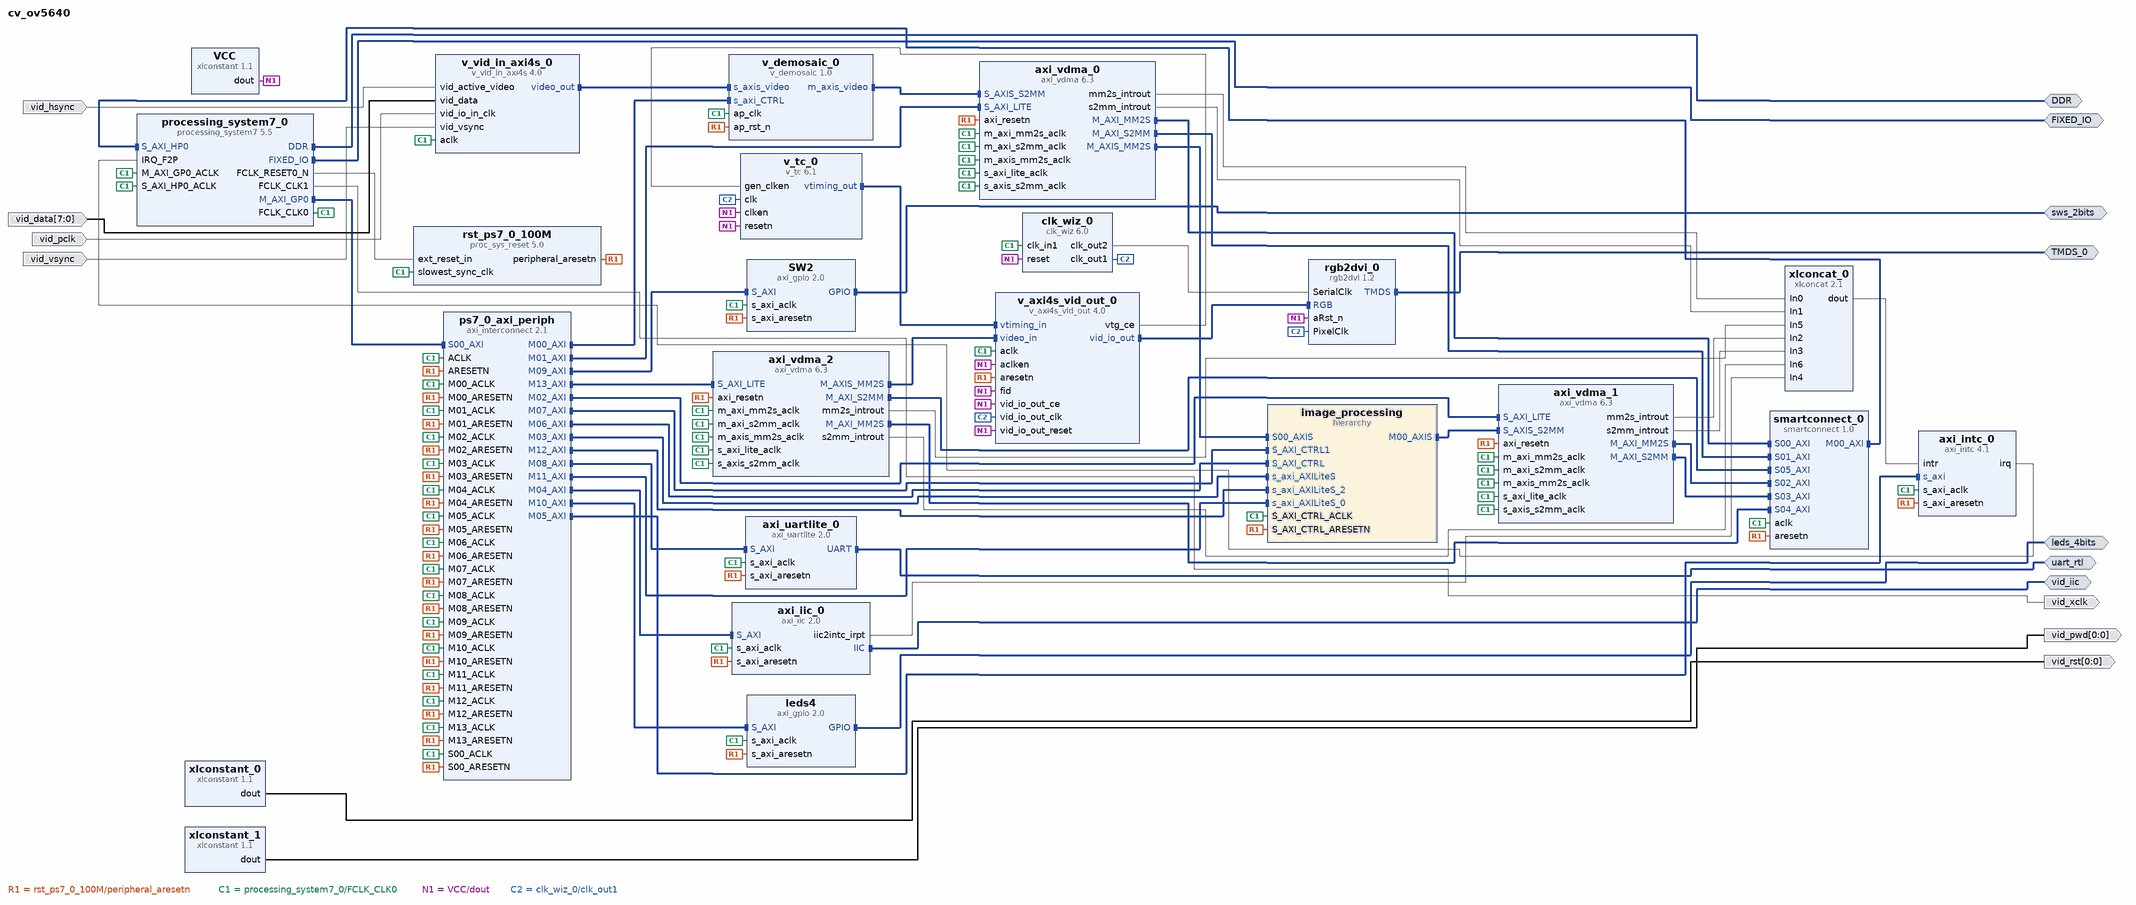
[diagram p0: block diagram of the top level]
# Vivado block design cv_ov5640, xc7z020clg400-1, Vivado 2018.3
create_bd_design cv_ov5640

create_bd_intf_port -mode Master -vlnv xilinx.com:interface:ddrx_rtl:1.0 DDR
create_bd_intf_port -mode Master -vlnv xilinx.com:display_processing_system7:fixedio_rtl:1.0 FIXED_IO
create_bd_intf_port -mode Master -vlnv digilentinc.com:interface:tmds_rtl:1.0 TMDS_0
create_bd_intf_port -mode Master -vlnv xilinx.com:interface:iic_rtl:1.0 vid_iic
create_bd_intf_port -mode Master -vlnv xilinx.com:interface:uart_rtl:1.0 uart_rtl
create_bd_intf_port -mode Master -vlnv xilinx.com:interface:gpio_rtl:1.0 sws_2bits
create_bd_intf_port -mode Master -vlnv xilinx.com:interface:gpio_rtl:1.0 leds_4bits
create_bd_port -dir I -from 7 -to 0 vid_data
create_bd_port -dir I vid_hsync
create_bd_port -dir I -type clk vid_pclk
set_property -dict {CONFIG.FREQ_HZ 74250000} [get_bd_ports vid_pclk]
create_bd_port -dir O -from 0 -to 0 vid_pwd
create_bd_port -dir O -from 0 -to 0 vid_rst
create_bd_port -dir I vid_vsync
create_bd_port -dir O -type clk vid_xclk
set_property -dict {CONFIG.FREQ_HZ 23809525} [get_bd_ports vid_xclk]

create_bd_cell -type ip -vlnv xilinx.com:ip:axi_iic:2.0 axi_iic_0
set_property -dict {CONFIG.IIC_FREQ_KHZ 100} [get_bd_cells axi_iic_0]
create_bd_cell -type ip -vlnv xilinx.com:ip:axi_intc:4.1 axi_intc_0
set_property -dict {CONFIG.C_IRQ_CONNECTION 1} [get_bd_cells axi_intc_0]
create_bd_cell -type ip -vlnv xilinx.com:ip:axi_vdma:6.3 axi_vdma_0
set_property -dict {CONFIG.c_m_axis_mm2s_tdata_width 24} [get_bd_cells axi_vdma_0]
create_bd_cell -type ip -vlnv xilinx.com:ip:axi_vdma:6.3 axi_vdma_1
set_property -dict {CONFIG.c_m_axis_mm2s_tdata_width 24 CONFIG.c_num_fstores 3} [get_bd_cells axi_vdma_1]
create_bd_cell -type ip -vlnv xilinx.com:ip:clk_wiz:6.0 clk_wiz_0
set_property -dict [list \
  CONFIG.CLKOUT1_JITTER 337.616 \
  CONFIG.CLKOUT1_PHASE_ERROR 322.999 \
  CONFIG.CLKOUT1_REQUESTED_OUT_FREQ 74.25 \
  CONFIG.CLKOUT2_JITTER 258.703 \
  CONFIG.CLKOUT2_PHASE_ERROR 322.999 \
  CONFIG.CLKOUT2_REQUESTED_OUT_FREQ 371.25 \
  CONFIG.CLKOUT2_USED true \
  CONFIG.MMCM_CLKFBOUT_MULT_F 37.125 \
  CONFIG.MMCM_CLKOUT0_DIVIDE_F 10.000 \
  CONFIG.MMCM_CLKOUT1_DIVIDE 2 \
  CONFIG.MMCM_DIVCLK_DIVIDE 5 \
  CONFIG.NUM_OUT_CLKS 2 \
  CONFIG.USE_LOCKED false \
  CONFIG.USE_RESET true \
] [get_bd_cells clk_wiz_0]
create_bd_cell -type hier image_processing
create_bd_cell -type ip -vlnv xilinx.com:ip:processing_system7:5.5 processing_system7_0
set_property -dict [list \
  CONFIG.PCW_APU_PERIPHERAL_FREQMHZ 650 \
  CONFIG.PCW_CRYSTAL_PERIPHERAL_FREQMHZ 50 \
  CONFIG.PCW_ENET0_ENET0_IO {MIO 16 .. 27} \
  CONFIG.PCW_ENET0_GRP_MDIO_ENABLE 1 \
  CONFIG.PCW_ENET0_GRP_MDIO_IO {MIO 52 .. 53} \
  CONFIG.PCW_ENET0_PERIPHERAL_ENABLE 1 \
  CONFIG.PCW_ENET0_RESET_ENABLE 1 \
  CONFIG.PCW_ENET0_RESET_IO {MIO 9} \
  CONFIG.PCW_ENET_RESET_ENABLE 1 \
  CONFIG.PCW_ENET_RESET_SELECT {Share reset pin} \
  CONFIG.PCW_EN_CLK1_PORT 1 \
  CONFIG.PCW_FPGA0_PERIPHERAL_FREQMHZ 100 \
  CONFIG.PCW_FPGA1_PERIPHERAL_FREQMHZ 24 \
  CONFIG.PCW_FPGA_FCLK1_ENABLE 1 \
  CONFIG.PCW_GPIO_MIO_GPIO_ENABLE 1 \
  CONFIG.PCW_GPIO_MIO_GPIO_IO MIO \
  CONFIG.PCW_I2C_RESET_ENABLE 1 \
  CONFIG.PCW_IRQ_F2P_INTR 1 \
  CONFIG.PCW_PERIPHERAL_BOARD_PRESET part0 \
  CONFIG.PCW_PRESET_BANK1_VOLTAGE {LVCMOS 1.8V} \
  CONFIG.PCW_QSPI_GRP_FBCLK_ENABLE 1 \
  CONFIG.PCW_QSPI_GRP_FBCLK_IO {MIO 8} \
  CONFIG.PCW_QSPI_GRP_SINGLE_SS_ENABLE 1 \
  CONFIG.PCW_QSPI_GRP_SINGLE_SS_IO {MIO 1 .. 6} \
  CONFIG.PCW_QSPI_PERIPHERAL_ENABLE 1 \
  CONFIG.PCW_QSPI_QSPI_IO {MIO 1 .. 6} \
  CONFIG.PCW_SD0_GRP_CD_ENABLE 1 \
  CONFIG.PCW_SD0_GRP_CD_IO {MIO 47} \
  CONFIG.PCW_SD0_GRP_WP_ENABLE 0 \
  CONFIG.PCW_SD0_PERIPHERAL_ENABLE 1 \
  CONFIG.PCW_SD0_SD0_IO {MIO 40 .. 45} \
  CONFIG.PCW_SDIO_PERIPHERAL_FREQMHZ 50 \
  CONFIG.PCW_SINGLE_QSPI_DATA_MODE x4 \
  CONFIG.PCW_UART0_PERIPHERAL_ENABLE 1 \
  CONFIG.PCW_UART0_UART0_IO {MIO 10 .. 11} \
  CONFIG.PCW_UART1_PERIPHERAL_ENABLE 0 \
  CONFIG.PCW_UART_PERIPHERAL_FREQMHZ 100 \
  CONFIG.PCW_UIPARAM_DDR_BUS_WIDTH {16 Bit} \
  CONFIG.PCW_UIPARAM_DDR_FREQ_MHZ 525 \
  CONFIG.PCW_UIPARAM_DDR_PARTNO {MT41J256M16 RE-125} \
  CONFIG.PCW_USB0_PERIPHERAL_ENABLE 1 \
  CONFIG.PCW_USB0_RESET_ENABLE 1 \
  CONFIG.PCW_USB0_RESET_IO {MIO 46} \
  CONFIG.PCW_USB0_USB0_IO {MIO 28 .. 39} \
  CONFIG.PCW_USB_RESET_ENABLE 1 \
  CONFIG.PCW_USB_RESET_SELECT {Share reset pin} \
  CONFIG.PCW_USE_FABRIC_INTERRUPT 1 \
  CONFIG.PCW_USE_S_AXI_HP0 1 \
] [get_bd_cells processing_system7_0]
# 492 more settings of processing_system7_0 are not shown: defaults, MIO pin electricals, DDR timing, and values the tool derives
create_bd_cell -type ip -vlnv xilinx.com:ip:axi_interconnect:2.1 ps7_0_axi_periph
set_property -dict {CONFIG.NUM_MI 14} [get_bd_cells ps7_0_axi_periph]
create_bd_cell -type ip -vlnv digilentinc.com:ip:rgb2dvi:1.2 rgb2dvi_0
set_property -dict {CONFIG.kClkRange 2 CONFIG.kGenerateSerialClk false CONFIG.kRstActiveHigh false} [get_bd_cells rgb2dvi_0]
create_bd_cell -type ip -vlnv xilinx.com:ip:proc_sys_reset:5.0 rst_ps7_0_100M
create_bd_cell -type ip -vlnv xilinx.com:ip:v_axi4s_vid_out:4.0 v_axi4s_vid_out_0
set_property -dict {CONFIG.C_ADDR_WIDTH 11 CONFIG.C_HAS_ASYNC_CLK 1 CONFIG.C_VTG_MASTER_SLAVE 0} [get_bd_cells v_axi4s_vid_out_0]
create_bd_cell -type ip -vlnv xilinx.com:ip:v_demosaic:1.0 v_demosaic_0
create_bd_cell -type ip -vlnv xilinx.com:ip:v_tc:6.1 v_tc_0
set_property -dict {CONFIG.HAS_AXI4_LITE false CONFIG.enable_detection false} [get_bd_cells v_tc_0]
create_bd_cell -type ip -vlnv xilinx.com:ip:v_vid_in_axi4s:4.0 v_vid_in_axi4s_0
set_property -dict [list \
  CONFIG.C_ADDR_WIDTH 11 \
  CONFIG.C_HAS_ASYNC_CLK 1 \
  CONFIG.C_M_AXIS_VIDEO_FORMAT 12 \
] [get_bd_cells v_vid_in_axi4s_0]
create_bd_cell -type ip -vlnv xilinx.com:ip:xlconcat:2.1 xlconcat_0
set_property -dict {CONFIG.NUM_PORTS 7} [get_bd_cells xlconcat_0]
create_bd_cell -type ip -vlnv xilinx.com:ip:xlconstant:1.1 xlconstant_0
create_bd_cell -type ip -vlnv xilinx.com:ip:xlconstant:1.1 xlconstant_1
set_property -dict {CONFIG.CONST_VAL 0} [get_bd_cells xlconstant_1]
create_bd_cell -type ip -vlnv xilinx.com:ip:axi_uartlite:2.0 axi_uartlite_0
set_property -dict {CONFIG.C_BAUDRATE 115200} [get_bd_cells axi_uartlite_0]
create_bd_cell -type ip -vlnv xilinx.com:ip:axi_gpio:2.0 SW2
set_property -dict [list \
  CONFIG.C_IS_DUAL 0 \
  CONFIG.GPIO2_BOARD_INTERFACE Custom \
  CONFIG.GPIO_BOARD_INTERFACE sws_2bits \
  CONFIG.USE_BOARD_FLOW true \
] [get_bd_cells SW2]
create_bd_cell -type ip -vlnv xilinx.com:ip:axi_gpio:2.0 leds4
set_property -dict {CONFIG.GPIO_BOARD_INTERFACE leds_4bits CONFIG.USE_BOARD_FLOW true} [get_bd_cells leds4]
create_bd_cell -type ip -vlnv xilinx.com:ip:axi_vdma:6.3 axi_vdma_2
set_property -dict [list \
  CONFIG.c_include_s2mm 1 \
  CONFIG.c_m_axis_mm2s_tdata_width 24 \
  CONFIG.c_num_fstores 4 \
  CONFIG.c_s2mm_genlock_mode 2 \
] [get_bd_cells axi_vdma_2]
create_bd_cell -type ip -vlnv xilinx.com:ip:smartconnect:1.0 smartconnect_0
set_property -dict {CONFIG.NUM_MI 1 CONFIG.NUM_SI 6} [get_bd_cells smartconnect_0]
create_bd_cell -type ip -vlnv xilinx.com:ip:xlconstant:1.1 VCC

# ---- hierarchy /image_processing ----
current_bd_instance /image_processing
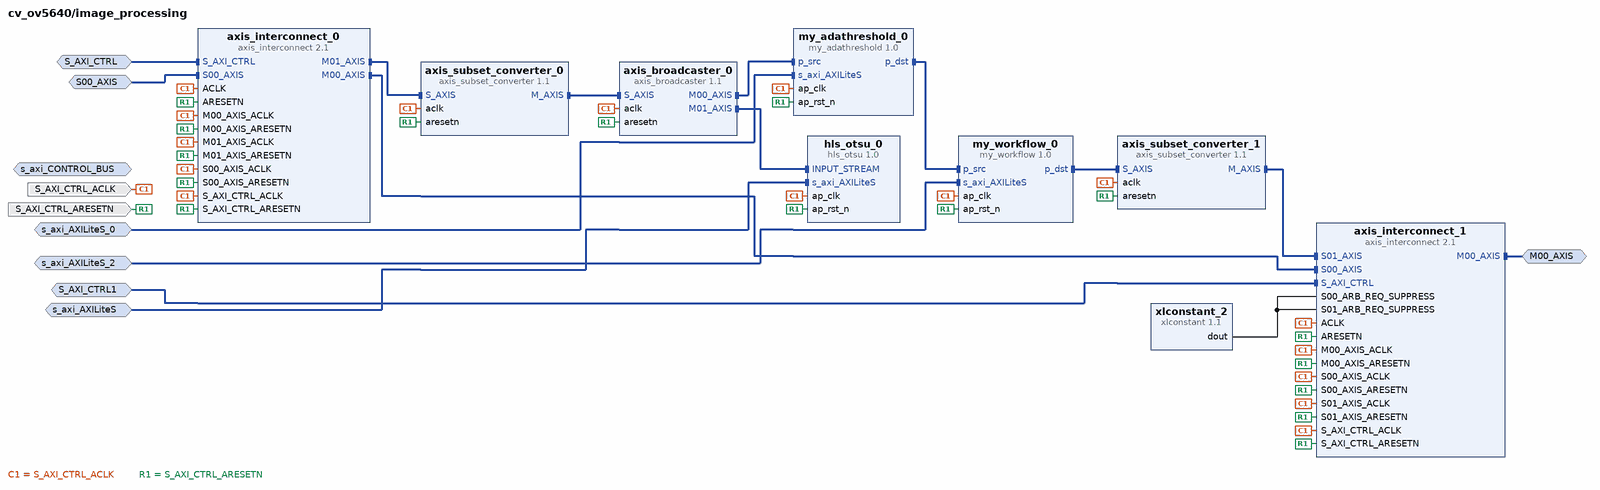
[diagram p1: block diagram inside /image_processing]
create_bd_intf_pin -mode Master -vlnv xilinx.com:interface:axis_rtl:1.0 M00_AXIS
create_bd_intf_pin -mode Slave -vlnv xilinx.com:interface:axis_rtl:1.0 S00_AXIS
create_bd_intf_pin -mode Slave -vlnv xilinx.com:interface:aximm_rtl:1.0 S_AXI_CTRL
create_bd_intf_pin -mode Slave -vlnv xilinx.com:interface:aximm_rtl:1.0 S_AXI_CTRL1
create_bd_intf_pin -mode Slave -vlnv xilinx.com:interface:aximm_rtl:1.0 s_axi_CONTROL_BUS
create_bd_intf_pin -mode Slave -vlnv xilinx.com:interface:aximm_rtl:1.0 s_axi_AXILiteS
create_bd_intf_pin -mode Slave -vlnv xilinx.com:interface:aximm_rtl:1.0 s_axi_AXILiteS_0
create_bd_intf_pin -mode Slave -vlnv xilinx.com:interface:aximm_rtl:1.0 s_axi_AXILiteS_2
create_bd_pin -dir I -type clk S_AXI_CTRL_ACLK
create_bd_pin -dir I -type rst S_AXI_CTRL_ARESETN

create_bd_cell -type ip -vlnv xilinx.com:ip:axis_interconnect:2.1 axis_interconnect_0
set_property -dict {CONFIG.NUM_MI 2 CONFIG.ROUTING_MODE 1} [get_bd_cells axis_interconnect_0]
create_bd_cell -type ip -vlnv xilinx.com:ip:axis_interconnect:2.1 axis_interconnect_1
set_property -dict {CONFIG.NUM_MI 1 CONFIG.NUM_SI 2 CONFIG.ROUTING_MODE 1} [get_bd_cells axis_interconnect_1]
create_bd_cell -type ip -vlnv xilinx.com:ip:axis_subset_converter:1.1 axis_subset_converter_0
set_property -dict [list \
  CONFIG.M_HAS_TKEEP 0 \
  CONFIG.M_HAS_TSTRB 0 \
  CONFIG.M_TDATA_NUM_BYTES 1 \
  CONFIG.M_TID_WIDTH 0 \
  CONFIG.S_HAS_TKEEP 0 \
  CONFIG.S_HAS_TSTRB 0 \
  CONFIG.S_TDATA_NUM_BYTES 3 \
  CONFIG.S_TID_WIDTH 0 \
  CONFIG.TDATA_REMAP {tdata[7:0]} \
  CONFIG.TID_REMAP {1'b0} \
  CONFIG.TKEEP_REMAP {1'b0} \
  CONFIG.TSTRB_REMAP {1'b0} \
] [get_bd_cells axis_subset_converter_0]
create_bd_cell -type ip -vlnv xilinx.com:ip:xlconstant:1.1 xlconstant_2
set_property -dict {CONFIG.CONST_VAL 0} [get_bd_cells xlconstant_2]
create_bd_cell -type ip -vlnv xilinx.com:ip:axis_subset_converter:1.1 axis_subset_converter_1
set_property -dict [list \
  CONFIG.M_HAS_TKEEP 0 \
  CONFIG.M_HAS_TSTRB 0 \
  CONFIG.M_TDATA_NUM_BYTES 3 \
  CONFIG.M_TID_WIDTH 0 \
  CONFIG.S_HAS_TKEEP 0 \
  CONFIG.S_HAS_TSTRB 0 \
  CONFIG.S_TDATA_NUM_BYTES 1 \
  CONFIG.S_TID_WIDTH 0 \
  CONFIG.TDATA_REMAP {tdata[7:0],tdata[7:0],tdata[7:0]} \
  CONFIG.TID_REMAP {1'b0} \
  CONFIG.TKEEP_REMAP {1'b0} \
  CONFIG.TSTRB_REMAP {1'b0} \
] [get_bd_cells axis_subset_converter_1]
create_bd_cell -type ip -vlnv xilinx.com:hls:my_adathreshold:1.0 my_adathreshold_0
create_bd_cell -type ip -vlnv xilinx.com:ip:axis_broadcaster:1.1 axis_broadcaster_0
create_bd_cell -type ip -vlnv xilinx.com:hls:hls_otsu:1.0 hls_otsu_0
create_bd_cell -type ip -vlnv xilinx.com:hls:my_workflow:1.0 my_workflow_0

# ---- connections ----

current_bd_instance /image_processing
connect_bd_intf_net [get_bd_intf_pins my_adathreshold_0/p_dst] [get_bd_intf_pins my_workflow_0/p_src]
connect_bd_intf_net [get_bd_intf_pins axis_interconnect_0/M01_AXIS] [get_bd_intf_pins axis_subset_converter_0/S_AXIS]
connect_bd_intf_net [get_bd_intf_pins axis_interconnect_0/M00_AXIS] [get_bd_intf_pins axis_interconnect_1/S00_AXIS]
connect_bd_intf_net -intf_net s_axi_AXILiteS_2_1 [get_bd_intf_pins s_axi_AXILiteS_2] [get_bd_intf_pins my_workflow_0/s_axi_AXILiteS]
connect_bd_intf_net [get_bd_intf_pins axis_broadcaster_0/M00_AXIS] [get_bd_intf_pins my_adathreshold_0/p_src]
connect_bd_intf_net [get_bd_intf_pins s_axi_AXILiteS_0] [get_bd_intf_pins my_adathreshold_0/s_axi_AXILiteS]
connect_bd_intf_net [get_bd_intf_pins S_AXI_CTRL1] [get_bd_intf_pins axis_interconnect_1/S_AXI_CTRL]
connect_bd_intf_net [get_bd_intf_pins S_AXI_CTRL] [get_bd_intf_pins axis_interconnect_0/S_AXI_CTRL]
connect_bd_intf_net [get_bd_intf_pins M00_AXIS] [get_bd_intf_pins axis_interconnect_1/M00_AXIS]
connect_bd_intf_net [get_bd_intf_pins my_workflow_0/p_dst] [get_bd_intf_pins axis_subset_converter_1/S_AXIS]
connect_bd_intf_net [get_bd_intf_pins s_axi_AXILiteS] [get_bd_intf_pins hls_otsu_0/s_axi_AXILiteS]
connect_bd_intf_net [get_bd_intf_pins axis_subset_converter_0/M_AXIS] [get_bd_intf_pins axis_broadcaster_0/S_AXIS]
connect_bd_intf_net [get_bd_intf_pins axis_subset_converter_1/M_AXIS] [get_bd_intf_pins axis_interconnect_1/S01_AXIS]
connect_bd_intf_net [get_bd_intf_pins S00_AXIS] [get_bd_intf_pins axis_interconnect_0/S00_AXIS]
connect_bd_intf_net [get_bd_intf_pins axis_broadcaster_0/M01_AXIS] [get_bd_intf_pins hls_otsu_0/INPUT_STREAM]
connect_bd_net -net processing_system7_0_FCLK_CLK0 [get_bd_pins S_AXI_CTRL_ACLK] \
  [get_bd_pins axis_interconnect_0/ACLK] [get_bd_pins axis_interconnect_0/M00_AXIS_ACLK] \
  [get_bd_pins axis_interconnect_0/M01_AXIS_ACLK] [get_bd_pins axis_interconnect_0/S00_AXIS_ACLK] \
  [get_bd_pins axis_interconnect_0/S_AXI_CTRL_ACLK] [get_bd_pins axis_interconnect_1/ACLK] \
  [get_bd_pins axis_interconnect_1/M00_AXIS_ACLK] [get_bd_pins axis_interconnect_1/S00_AXIS_ACLK] \
  [get_bd_pins axis_interconnect_1/S01_AXIS_ACLK] [get_bd_pins axis_interconnect_1/S_AXI_CTRL_ACLK] \
  [get_bd_pins axis_subset_converter_0/aclk] [get_bd_pins axis_subset_converter_1/aclk] \
  [get_bd_pins my_adathreshold_0/ap_clk] [get_bd_pins axis_broadcaster_0/aclk] [get_bd_pins hls_otsu_0/ap_clk] \
  [get_bd_pins my_workflow_0/ap_clk]
connect_bd_net -net rst_ps7_0_100M_peripheral_aresetn [get_bd_pins S_AXI_CTRL_ARESETN] \
  [get_bd_pins axis_interconnect_0/ARESETN] [get_bd_pins axis_interconnect_0/M00_AXIS_ARESETN] \
  [get_bd_pins axis_interconnect_0/M01_AXIS_ARESETN] [get_bd_pins axis_interconnect_0/S00_AXIS_ARESETN] \
  [get_bd_pins axis_interconnect_0/S_AXI_CTRL_ARESETN] [get_bd_pins axis_interconnect_1/ARESETN] \
  [get_bd_pins axis_interconnect_1/M00_AXIS_ARESETN] [get_bd_pins axis_interconnect_1/S00_AXIS_ARESETN] \
  [get_bd_pins axis_interconnect_1/S01_AXIS_ARESETN] [get_bd_pins axis_interconnect_1/S_AXI_CTRL_ARESETN] \
  [get_bd_pins axis_subset_converter_0/aresetn] [get_bd_pins axis_subset_converter_1/aresetn] \
  [get_bd_pins my_adathreshold_0/ap_rst_n] [get_bd_pins axis_broadcaster_0/aresetn] [get_bd_pins hls_otsu_0/ap_rst_n] \
  [get_bd_pins my_workflow_0/ap_rst_n]
connect_bd_net [get_bd_pins xlconstant_2/dout] \
  [get_bd_pins axis_interconnect_1/S00_ARB_REQ_SUPPRESS] [get_bd_pins axis_interconnect_1/S01_ARB_REQ_SUPPRESS]

current_bd_instance /
connect_bd_intf_net [get_bd_intf_ports uart_rtl] [get_bd_intf_pins axi_uartlite_0/UART]
connect_bd_intf_net [get_bd_intf_pins axi_vdma_1/S_AXI_LITE] [get_bd_intf_pins ps7_0_axi_periph/M02_AXI]
connect_bd_intf_net [get_bd_intf_pins v_axi4s_vid_out_0/vtiming_in] [get_bd_intf_pins v_tc_0/vtiming_out]
connect_bd_intf_net [get_bd_intf_pins ps7_0_axi_periph/M00_AXI] [get_bd_intf_pins v_demosaic_0/s_axi_CTRL]
connect_bd_intf_net [get_bd_intf_ports DDR] [get_bd_intf_pins processing_system7_0/DDR]
connect_bd_intf_net [get_bd_intf_pins image_processing/S_AXI_CTRL1] [get_bd_intf_pins ps7_0_axi_periph/M07_AXI]
connect_bd_intf_net [get_bd_intf_pins processing_system7_0/M_AXI_GP0] [get_bd_intf_pins ps7_0_axi_periph/S00_AXI]
connect_bd_intf_net -intf_net axi_gpio_0_GPIO [get_bd_intf_ports sws_2bits] [get_bd_intf_pins SW2/GPIO]
connect_bd_intf_net [get_bd_intf_pins axi_vdma_0/S_AXIS_S2MM] [get_bd_intf_pins v_demosaic_0/m_axis_video]
connect_bd_intf_net [get_bd_intf_pins axi_vdma_1/M_AXI_MM2S] [get_bd_intf_pins smartconnect_0/S02_AXI]
connect_bd_intf_net [get_bd_intf_pins ps7_0_axi_periph/M13_AXI] [get_bd_intf_pins axi_vdma_2/S_AXI_LITE]
connect_bd_intf_net [get_bd_intf_pins axi_vdma_2/M_AXI_S2MM] [get_bd_intf_pins smartconnect_0/S05_AXI]
connect_bd_intf_net [get_bd_intf_ports FIXED_IO] [get_bd_intf_pins processing_system7_0/FIXED_IO]
connect_bd_intf_net [get_bd_intf_pins axi_vdma_0/M_AXIS_MM2S] [get_bd_intf_pins image_processing/S00_AXIS]
connect_bd_intf_net [get_bd_intf_pins image_processing/S_AXI_CTRL] [get_bd_intf_pins ps7_0_axi_periph/M06_AXI]
connect_bd_intf_net [get_bd_intf_pins ps7_0_axi_periph/M10_AXI] [get_bd_intf_pins leds4/S_AXI]
connect_bd_intf_net [get_bd_intf_ports TMDS_0] [get_bd_intf_pins rgb2dvi_0/TMDS]
connect_bd_intf_net [get_bd_intf_pins ps7_0_axi_periph/M03_AXI] [get_bd_intf_pins image_processing/s_axi_AXILiteS]
connect_bd_intf_net [get_bd_intf_pins axi_vdma_0/M_AXI_MM2S] [get_bd_intf_pins smartconnect_0/S00_AXI]
connect_bd_intf_net [get_bd_intf_pins axi_intc_0/s_axi] [get_bd_intf_pins ps7_0_axi_periph/M05_AXI]
connect_bd_intf_net [get_bd_intf_ports leds_4bits] [get_bd_intf_pins leds4/GPIO]
connect_bd_intf_net [get_bd_intf_pins ps7_0_axi_periph/M08_AXI] [get_bd_intf_pins axi_uartlite_0/S_AXI]
connect_bd_intf_net [get_bd_intf_pins axi_vdma_1/M_AXI_S2MM] [get_bd_intf_pins smartconnect_0/S03_AXI]
connect_bd_intf_net [get_bd_intf_pins axi_vdma_0/M_AXI_S2MM] [get_bd_intf_pins smartconnect_0/S01_AXI]
connect_bd_intf_net [get_bd_intf_pins smartconnect_0/M00_AXI] [get_bd_intf_pins processing_system7_0/S_AXI_HP0]
connect_bd_intf_net -intf_net axis_interconnect_1_M00_AXIS [get_bd_intf_pins axi_vdma_1/S_AXIS_S2MM] [get_bd_intf_pins image_processing/M00_AXIS]
connect_bd_intf_net [get_bd_intf_pins axi_vdma_2/M_AXI_MM2S] [get_bd_intf_pins smartconnect_0/S04_AXI]
connect_bd_intf_net [get_bd_intf_pins ps7_0_axi_periph/M12_AXI] [get_bd_intf_pins image_processing/s_axi_AXILiteS_2]
connect_bd_intf_net [get_bd_intf_pins axi_vdma_0/S_AXI_LITE] [get_bd_intf_pins ps7_0_axi_periph/M01_AXI]
connect_bd_intf_net [get_bd_intf_ports vid_iic] [get_bd_intf_pins axi_iic_0/IIC]
connect_bd_intf_net [get_bd_intf_pins ps7_0_axi_periph/M11_AXI] [get_bd_intf_pins image_processing/s_axi_AXILiteS_0]
connect_bd_intf_net [get_bd_intf_pins axi_vdma_2/M_AXIS_MM2S] [get_bd_intf_pins v_axi4s_vid_out_0/video_in]
connect_bd_intf_net [get_bd_intf_pins rgb2dvi_0/RGB] [get_bd_intf_pins v_axi4s_vid_out_0/vid_io_out]
connect_bd_intf_net [get_bd_intf_pins ps7_0_axi_periph/M09_AXI] [get_bd_intf_pins SW2/S_AXI]
connect_bd_intf_net [get_bd_intf_pins axi_iic_0/S_AXI] [get_bd_intf_pins ps7_0_axi_periph/M04_AXI]
connect_bd_intf_net [get_bd_intf_pins v_demosaic_0/s_axis_video] [get_bd_intf_pins v_vid_in_axi4s_0/video_out]
connect_bd_net [get_bd_pins axi_intc_0/irq] [get_bd_pins processing_system7_0/IRQ_F2P]
connect_bd_net [get_bd_pins axi_vdma_0/mm2s_introut] [get_bd_pins xlconcat_0/In0]
connect_bd_net [get_bd_pins axi_vdma_0/s2mm_introut] [get_bd_pins xlconcat_0/In1]
connect_bd_net [get_bd_pins axi_vdma_1/mm2s_introut] [get_bd_pins xlconcat_0/In2]
connect_bd_net [get_bd_pins axi_vdma_1/s2mm_introut] [get_bd_pins xlconcat_0/In3]
connect_bd_net [get_bd_pins processing_system7_0/FCLK_CLK1] [get_bd_ports vid_xclk]
connect_bd_net [get_bd_pins processing_system7_0/FCLK_RESET0_N] [get_bd_pins rst_ps7_0_100M/ext_reset_in]
connect_bd_net [get_bd_pins rst_ps7_0_100M/peripheral_aresetn] \
  [get_bd_pins axi_iic_0/s_axi_aresetn] [get_bd_pins axi_intc_0/s_axi_aresetn] [get_bd_pins axi_vdma_0/axi_resetn] \
  [get_bd_pins axi_vdma_1/axi_resetn] [get_bd_pins image_processing/S_AXI_CTRL_ARESETN] \
  [get_bd_pins ps7_0_axi_periph/ARESETN] [get_bd_pins ps7_0_axi_periph/M00_ARESETN] \
  [get_bd_pins ps7_0_axi_periph/M01_ARESETN] [get_bd_pins ps7_0_axi_periph/M02_ARESETN] \
  [get_bd_pins ps7_0_axi_periph/M03_ARESETN] [get_bd_pins ps7_0_axi_periph/M04_ARESETN] \
  [get_bd_pins ps7_0_axi_periph/M05_ARESETN] [get_bd_pins ps7_0_axi_periph/M06_ARESETN] \
  [get_bd_pins ps7_0_axi_periph/M07_ARESETN] [get_bd_pins ps7_0_axi_periph/M08_ARESETN] \
  [get_bd_pins ps7_0_axi_periph/S00_ARESETN] [get_bd_pins v_demosaic_0/ap_rst_n] [get_bd_pins axi_uartlite_0/s_axi_aresetn] \
  [get_bd_pins SW2/s_axi_aresetn] [get_bd_pins ps7_0_axi_periph/M09_ARESETN] [get_bd_pins leds4/s_axi_aresetn] \
  [get_bd_pins ps7_0_axi_periph/M10_ARESETN] [get_bd_pins ps7_0_axi_periph/M11_ARESETN] \
  [get_bd_pins ps7_0_axi_periph/M12_ARESETN] [get_bd_pins axi_vdma_2/axi_resetn] [get_bd_pins ps7_0_axi_periph/M13_ARESETN] \
  [get_bd_pins smartconnect_0/aresetn] [get_bd_pins v_axi4s_vid_out_0/aresetn]
connect_bd_net -net vid_active_video_0_1 [get_bd_ports vid_hsync] [get_bd_pins v_vid_in_axi4s_0/vid_active_video]
connect_bd_net -net vid_data_0_1 [get_bd_ports vid_data] [get_bd_pins v_vid_in_axi4s_0/vid_data]
connect_bd_net -net vid_io_in_clk_0_1 [get_bd_ports vid_pclk] [get_bd_pins v_vid_in_axi4s_0/vid_io_in_clk]
connect_bd_net -net vid_vsync_0_1 [get_bd_ports vid_vsync] [get_bd_pins v_vid_in_axi4s_0/vid_vsync]
connect_bd_net [get_bd_pins xlconcat_0/dout] [get_bd_pins axi_intc_0/intr]
connect_bd_net [get_bd_pins xlconstant_0/dout] [get_bd_ports vid_rst]
connect_bd_net [get_bd_pins xlconstant_1/dout] [get_bd_ports vid_pwd]
connect_bd_net [get_bd_pins axi_iic_0/iic2intc_irpt] [get_bd_pins xlconcat_0/In4]
connect_bd_net [get_bd_pins processing_system7_0/FCLK_CLK0] \
  [get_bd_pins axi_iic_0/s_axi_aclk] [get_bd_pins axi_intc_0/s_axi_aclk] [get_bd_pins axi_vdma_0/m_axi_mm2s_aclk] \
  [get_bd_pins axi_vdma_0/m_axi_s2mm_aclk] [get_bd_pins axi_vdma_0/m_axis_mm2s_aclk] [get_bd_pins axi_vdma_0/s_axi_lite_aclk] \
  [get_bd_pins axi_vdma_0/s_axis_s2mm_aclk] [get_bd_pins axi_vdma_1/m_axi_mm2s_aclk] [get_bd_pins axi_vdma_1/m_axi_s2mm_aclk] \
  [get_bd_pins axi_vdma_1/s_axi_lite_aclk] [get_bd_pins axi_vdma_1/s_axis_s2mm_aclk] [get_bd_pins clk_wiz_0/clk_in1] \
  [get_bd_pins image_processing/S_AXI_CTRL_ACLK] [get_bd_pins processing_system7_0/M_AXI_GP0_ACLK] \
  [get_bd_pins processing_system7_0/S_AXI_HP0_ACLK] [get_bd_pins ps7_0_axi_periph/ACLK] \
  [get_bd_pins ps7_0_axi_periph/M00_ACLK] [get_bd_pins ps7_0_axi_periph/M01_ACLK] [get_bd_pins ps7_0_axi_periph/M02_ACLK] \
  [get_bd_pins ps7_0_axi_periph/M03_ACLK] [get_bd_pins ps7_0_axi_periph/M04_ACLK] [get_bd_pins ps7_0_axi_periph/M05_ACLK] \
  [get_bd_pins ps7_0_axi_periph/M06_ACLK] [get_bd_pins ps7_0_axi_periph/M07_ACLK] [get_bd_pins ps7_0_axi_periph/M08_ACLK] \
  [get_bd_pins ps7_0_axi_periph/S00_ACLK] [get_bd_pins rst_ps7_0_100M/slowest_sync_clk] [get_bd_pins v_demosaic_0/ap_clk] \
  [get_bd_pins v_vid_in_axi4s_0/aclk] [get_bd_pins axi_uartlite_0/s_axi_aclk] [get_bd_pins SW2/s_axi_aclk] \
  [get_bd_pins ps7_0_axi_periph/M09_ACLK] [get_bd_pins leds4/s_axi_aclk] [get_bd_pins ps7_0_axi_periph/M10_ACLK] \
  [get_bd_pins ps7_0_axi_periph/M11_ACLK] [get_bd_pins ps7_0_axi_periph/M12_ACLK] [get_bd_pins axi_vdma_2/s_axi_lite_aclk] \
  [get_bd_pins ps7_0_axi_periph/M13_ACLK] [get_bd_pins axi_vdma_2/m_axi_mm2s_aclk] [get_bd_pins axi_vdma_2/m_axi_s2mm_aclk] \
  [get_bd_pins axi_vdma_2/s_axis_s2mm_aclk] [get_bd_pins smartconnect_0/aclk] [get_bd_pins v_axi4s_vid_out_0/aclk] \
  [get_bd_pins axi_vdma_2/m_axis_mm2s_aclk] [get_bd_pins axi_vdma_1/m_axis_mm2s_aclk]
connect_bd_net [get_bd_pins axi_vdma_2/mm2s_introut] [get_bd_pins xlconcat_0/In5]
connect_bd_net [get_bd_pins axi_vdma_2/s2mm_introut] [get_bd_pins xlconcat_0/In6]
connect_bd_net [get_bd_pins VCC/dout] \
  [get_bd_pins v_tc_0/clken] [get_bd_pins v_tc_0/resetn] [get_bd_pins v_axi4s_vid_out_0/aclken] \
  [get_bd_pins v_axi4s_vid_out_0/vid_io_out_ce] [get_bd_pins clk_wiz_0/reset] [get_bd_pins v_axi4s_vid_out_0/fid] \
  [get_bd_pins v_axi4s_vid_out_0/vid_io_out_reset] [get_bd_pins rgb2dvi_0/aRst_n]
connect_bd_net [get_bd_pins clk_wiz_0/clk_out1] \
  [get_bd_pins v_tc_0/clk] [get_bd_pins v_axi4s_vid_out_0/vid_io_out_clk] [get_bd_pins rgb2dvi_0/PixelClk]
connect_bd_net [get_bd_pins clk_wiz_0/clk_out2] [get_bd_pins rgb2dvi_0/SerialClk]
connect_bd_net [get_bd_pins v_axi4s_vid_out_0/vtg_ce] [get_bd_pins v_tc_0/gen_clken]

# ---- address map ----
assign_bd_address -offset 0x00000000 -range 512M -target_address_space [get_bd_addr_spaces axi_vdma_0/Data_MM2S] [get_bd_addr_segs processing_system7_0/S_AXI_HP0/HP0_DDR_LOWOCM]
assign_bd_address -offset 0x00000000 -range 512M -target_address_space [get_bd_addr_spaces axi_vdma_0/Data_S2MM] [get_bd_addr_segs processing_system7_0/S_AXI_HP0/HP0_DDR_LOWOCM]
assign_bd_address -offset 0x00000000 -range 512M -target_address_space [get_bd_addr_spaces axi_vdma_1/Data_MM2S] [get_bd_addr_segs processing_system7_0/S_AXI_HP0/HP0_DDR_LOWOCM]
assign_bd_address -offset 0x00000000 -range 512M -target_address_space [get_bd_addr_spaces axi_vdma_1/Data_S2MM] [get_bd_addr_segs processing_system7_0/S_AXI_HP0/HP0_DDR_LOWOCM]
assign_bd_address -offset 0x00000000 -range 512M -target_address_space [get_bd_addr_spaces axi_vdma_2/Data_MM2S] [get_bd_addr_segs processing_system7_0/S_AXI_HP0/HP0_DDR_LOWOCM]
assign_bd_address -offset 0x00000000 -range 512M -target_address_space [get_bd_addr_spaces axi_vdma_2/Data_S2MM] [get_bd_addr_segs processing_system7_0/S_AXI_HP0/HP0_DDR_LOWOCM]
assign_bd_address -offset 0x41200000 -range 64K -target_address_space [get_bd_addr_spaces processing_system7_0/Data] [get_bd_addr_segs SW2/S_AXI/Reg]
assign_bd_address -offset 0x41210000 -range 64K -target_address_space [get_bd_addr_spaces processing_system7_0/Data] [get_bd_addr_segs leds4/S_AXI/Reg]
assign_bd_address -offset 0x41600000 -range 64K -target_address_space [get_bd_addr_spaces processing_system7_0/Data] [get_bd_addr_segs axi_iic_0/S_AXI/Reg]
assign_bd_address -offset 0x41800000 -range 64K -target_address_space [get_bd_addr_spaces processing_system7_0/Data] [get_bd_addr_segs axi_intc_0/S_AXI/Reg]
assign_bd_address -offset 0x42C00000 -range 64K -target_address_space [get_bd_addr_spaces processing_system7_0/Data] [get_bd_addr_segs axi_uartlite_0/S_AXI/Reg]
assign_bd_address -offset 0x43000000 -range 64K -target_address_space [get_bd_addr_spaces processing_system7_0/Data] [get_bd_addr_segs axi_vdma_0/S_AXI_LITE/Reg]
assign_bd_address -offset 0x43010000 -range 64K -target_address_space [get_bd_addr_spaces processing_system7_0/Data] [get_bd_addr_segs axi_vdma_1/S_AXI_LITE/Reg]
assign_bd_address -offset 0x43020000 -range 64K -target_address_space [get_bd_addr_spaces processing_system7_0/Data] [get_bd_addr_segs axi_vdma_2/S_AXI_LITE/Reg]
assign_bd_address -offset 0x43C00000 -range 64K -target_address_space [get_bd_addr_spaces processing_system7_0/Data] [get_bd_addr_segs v_demosaic_0/s_axi_CTRL/Reg]
assign_bd_address -offset 0x43C10000 -range 64K -target_address_space [get_bd_addr_spaces processing_system7_0/Data] [get_bd_addr_segs image_processing/my_adathreshold_0/s_axi_AXILiteS/Reg]
assign_bd_address -offset 0x43C20000 -range 64K -target_address_space [get_bd_addr_spaces processing_system7_0/Data] [get_bd_addr_segs image_processing/axis_interconnect_0/xbar/S_AXI_CTRL/Reg]
assign_bd_address -offset 0x43C30000 -range 64K -target_address_space [get_bd_addr_spaces processing_system7_0/Data] [get_bd_addr_segs image_processing/axis_interconnect_1/xbar/S_AXI_CTRL/Reg]
assign_bd_address -offset 0x43C40000 -range 64K -target_address_space [get_bd_addr_spaces processing_system7_0/Data] [get_bd_addr_segs image_processing/hls_otsu_0/s_axi_AXILiteS/Reg]
assign_bd_address -offset 0x43C50000 -range 64K -target_address_space [get_bd_addr_spaces processing_system7_0/Data] [get_bd_addr_segs image_processing/my_workflow_0/s_axi_AXILiteS/Reg]

validate_bd_design
save_bd_design
